# Altium project pcb_project.prjpcb (part 2 of 2)

## Sheet Analog_Current_Output.SchDoc
size A3; Organization: Altium Limited; Address1: L3, 12a Rodborough Rd; Address2: Frenchs Forest; Address3: NSW; Address4: Australia 2086
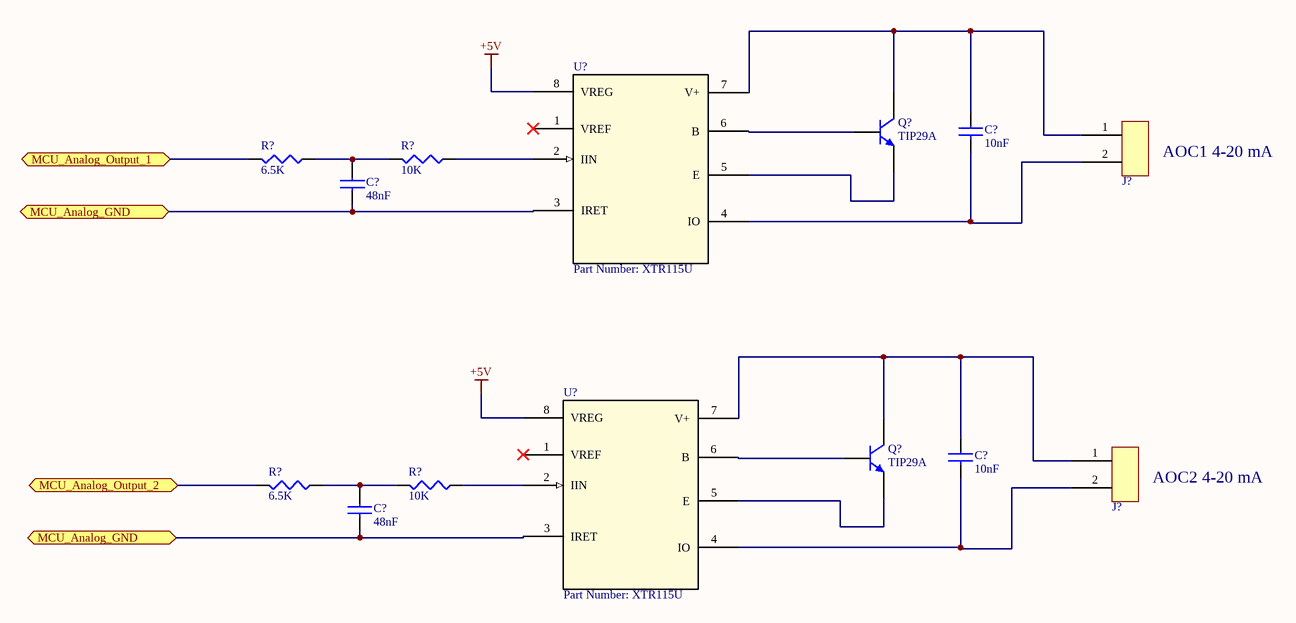
[diagram p8: Analog_Current_Output.SchDoc]

### Parts
(Parts that share a designator on the sheet are numbered #1, #2 ... from top to bottom, then left to right.)
C?#31  value 10nF  [0402 SMD Ceramic Capacitor]  (hidden comment: 0402_10nF)
C?#32  value 48nF  [0805 SMD Ceramic Capacitor]  (hidden comment: C0805C333)
C?#33  value 10nF  [0402 SMD Ceramic Capacitor]  (hidden comment: 0402_10nF)
C?#34  value 48nF  [0805 SMD Ceramic Capacitor]  (hidden comment: C0805C333)
J?#18  2x Terminal  [2x Terminal mini]  (value not drawn)
J?#19  2x Terminal  [2x Terminal mini]  (value not drawn)
Q?#2  TIP29A  [TO220 SMD]
Q?#3  TIP29A  [TO220 SMD]
R?#56  value 6.5K  [0805 Resistor]  (hidden comment: 0805_1K)
R?#57  value 10K  [0805 Resistor]  (hidden comment: 0805_1K)
R?#58  value 6.5K  [0805 Resistor]  (hidden comment: 0805_1K)
R?#59  value 10K  [0805 Resistor]  (hidden comment: 0805_1K)
U?#17  Part Number: XTR115U  [D8]
U?#18  Part Number: XTR115U  [D8]

### Ports
MCU_Analog_GND (bidir), MCU_Analog_Output_1 (bidir), MCU_Analog_Output_2 (bidir)

### Nets
+5V: U?#17.8(VREG) U?#18.8(VREG)
NetC?#31_1: C?#31.1 J?#18.1 Q?#2.2(C) U?#17.7(V+)
NetC?#31_2: C?#31.2 J?#18.2 U?#17.4(IO)
NetC?#32_1: C?#32.1 R?#56.1 R?#57.2
NetC?#32_2: C?#32.2 C?#34.2 U?#17.3(IRET) U?#18.3(IRET) ; port MCU_Analog_GND
NetC?#33_1: C?#33.1 J?#19.1 Q?#3.2(C) U?#18.7(V+)
NetC?#33_2: C?#33.2 J?#19.2 U?#18.4(IO)
NetC?#34_1: C?#34.1 R?#58.1 R?#59.2
NetQ?#2_1: Q?#2.1(B) U?#17.6(B)
NetQ?#2_3: Q?#2.3(E) U?#17.5(E)
NetQ?#3_1: Q?#3.1(B) U?#18.6(B)
NetQ?#3_3: Q?#3.3(E) U?#18.5(E)
NetR?#56_2: R?#56.2 ; port MCU_Analog_Output_1
NetR?#57_1: R?#57.1 U?#17.2(IIN)
NetR?#58_2: R?#58.2 ; port MCU_Analog_Output_2
NetR?#59_1: R?#59.1 U?#18.2(IIN)

Not connected (* = marked no-connect by the designer): U?#17 1(VREF)*; U?#18 1(VREF)*

### Notes on the sheet
- (near J?#18) AOC1 4-20 mA
- (near J?#19) AOC2 4-20 mA
- Title
- Size:
- Date:
- A3
- Number:
- Time:
- Revision:
- Sheet
- of
- File:

### Library data of the parts
C?#31 C?#33 = 0402_10nF: Manufacturer: MURATA; Manufacturer Code: GRM155R71C103KA01D; Tolerance: ±10%; Voltage: 25V; Dielectric Characteristic: X7R; Unit Price: 0,014 €; Farnell Code: 8819734; MOQ: 10; Package: 0402
C?#32 C?#34 = C0805C333: Manufacturer Code: MC0805B333K500CT; Manufacturer: MULTICOMP; Voltage: 50V; Tolerace: ± 10%; Farnell Code: 1759257; Unit Price: 0,022 €; MOQ: 10; Package: 0805
J?#18 J?#19 = 2x Terminal: Manufacturer: WEIDMULLER; Manufacturer Code: PM5.08/2/90 BLK; Value: 2x Terminal; Farnell Code: 1131855; Unit Price: 0,55 €
Q?#2 Q?#3 = TIP29A: Manufacturer: STM Electronics; Voltage: 60V; Manufacturer Code: TIP29A; Unit Price: 0,19 €; Q?: TIP29A
R?#56-R?#59 = 0805_1K: Manufacturer Code: MC01W080511K; Manufacturer: MULTICOMP; Tolerance: ±1%; Farnell Code: 9332383; Unit Price: 0,03 €
U?#17 U?#18 = XTR115U: 4-20mA Current Loop Transmitters; Manufacturer: Texas Instruments; GENERIC_PART_NUMBER: XTR115; INDUSTRY_STD_PKG_TYPE: SOIC; FAMILY_NAME: 4-20MA CONDITIONING; PIN_COUNT: 8; PACKAGE_DESIGNATOR: D; Datasheet_URL: http://www.ti.com/lit/gpn/XTR115; Vendor: Texas Instruments; Manufacturer_Part_Number: XTR115U; Copyright: Copyright (C) 2018 Accelerated Designs. All rights reserved; RefDes: RefDes; Type: DEV; Value: Value

## Sheet Frequency_Output.SchDoc
size A3; Organization: Altium Limited; Address1: L3, 12a Rodborough Rd; Address2: Frenchs Forest; Address3: NSW; Address4: Australia 2086
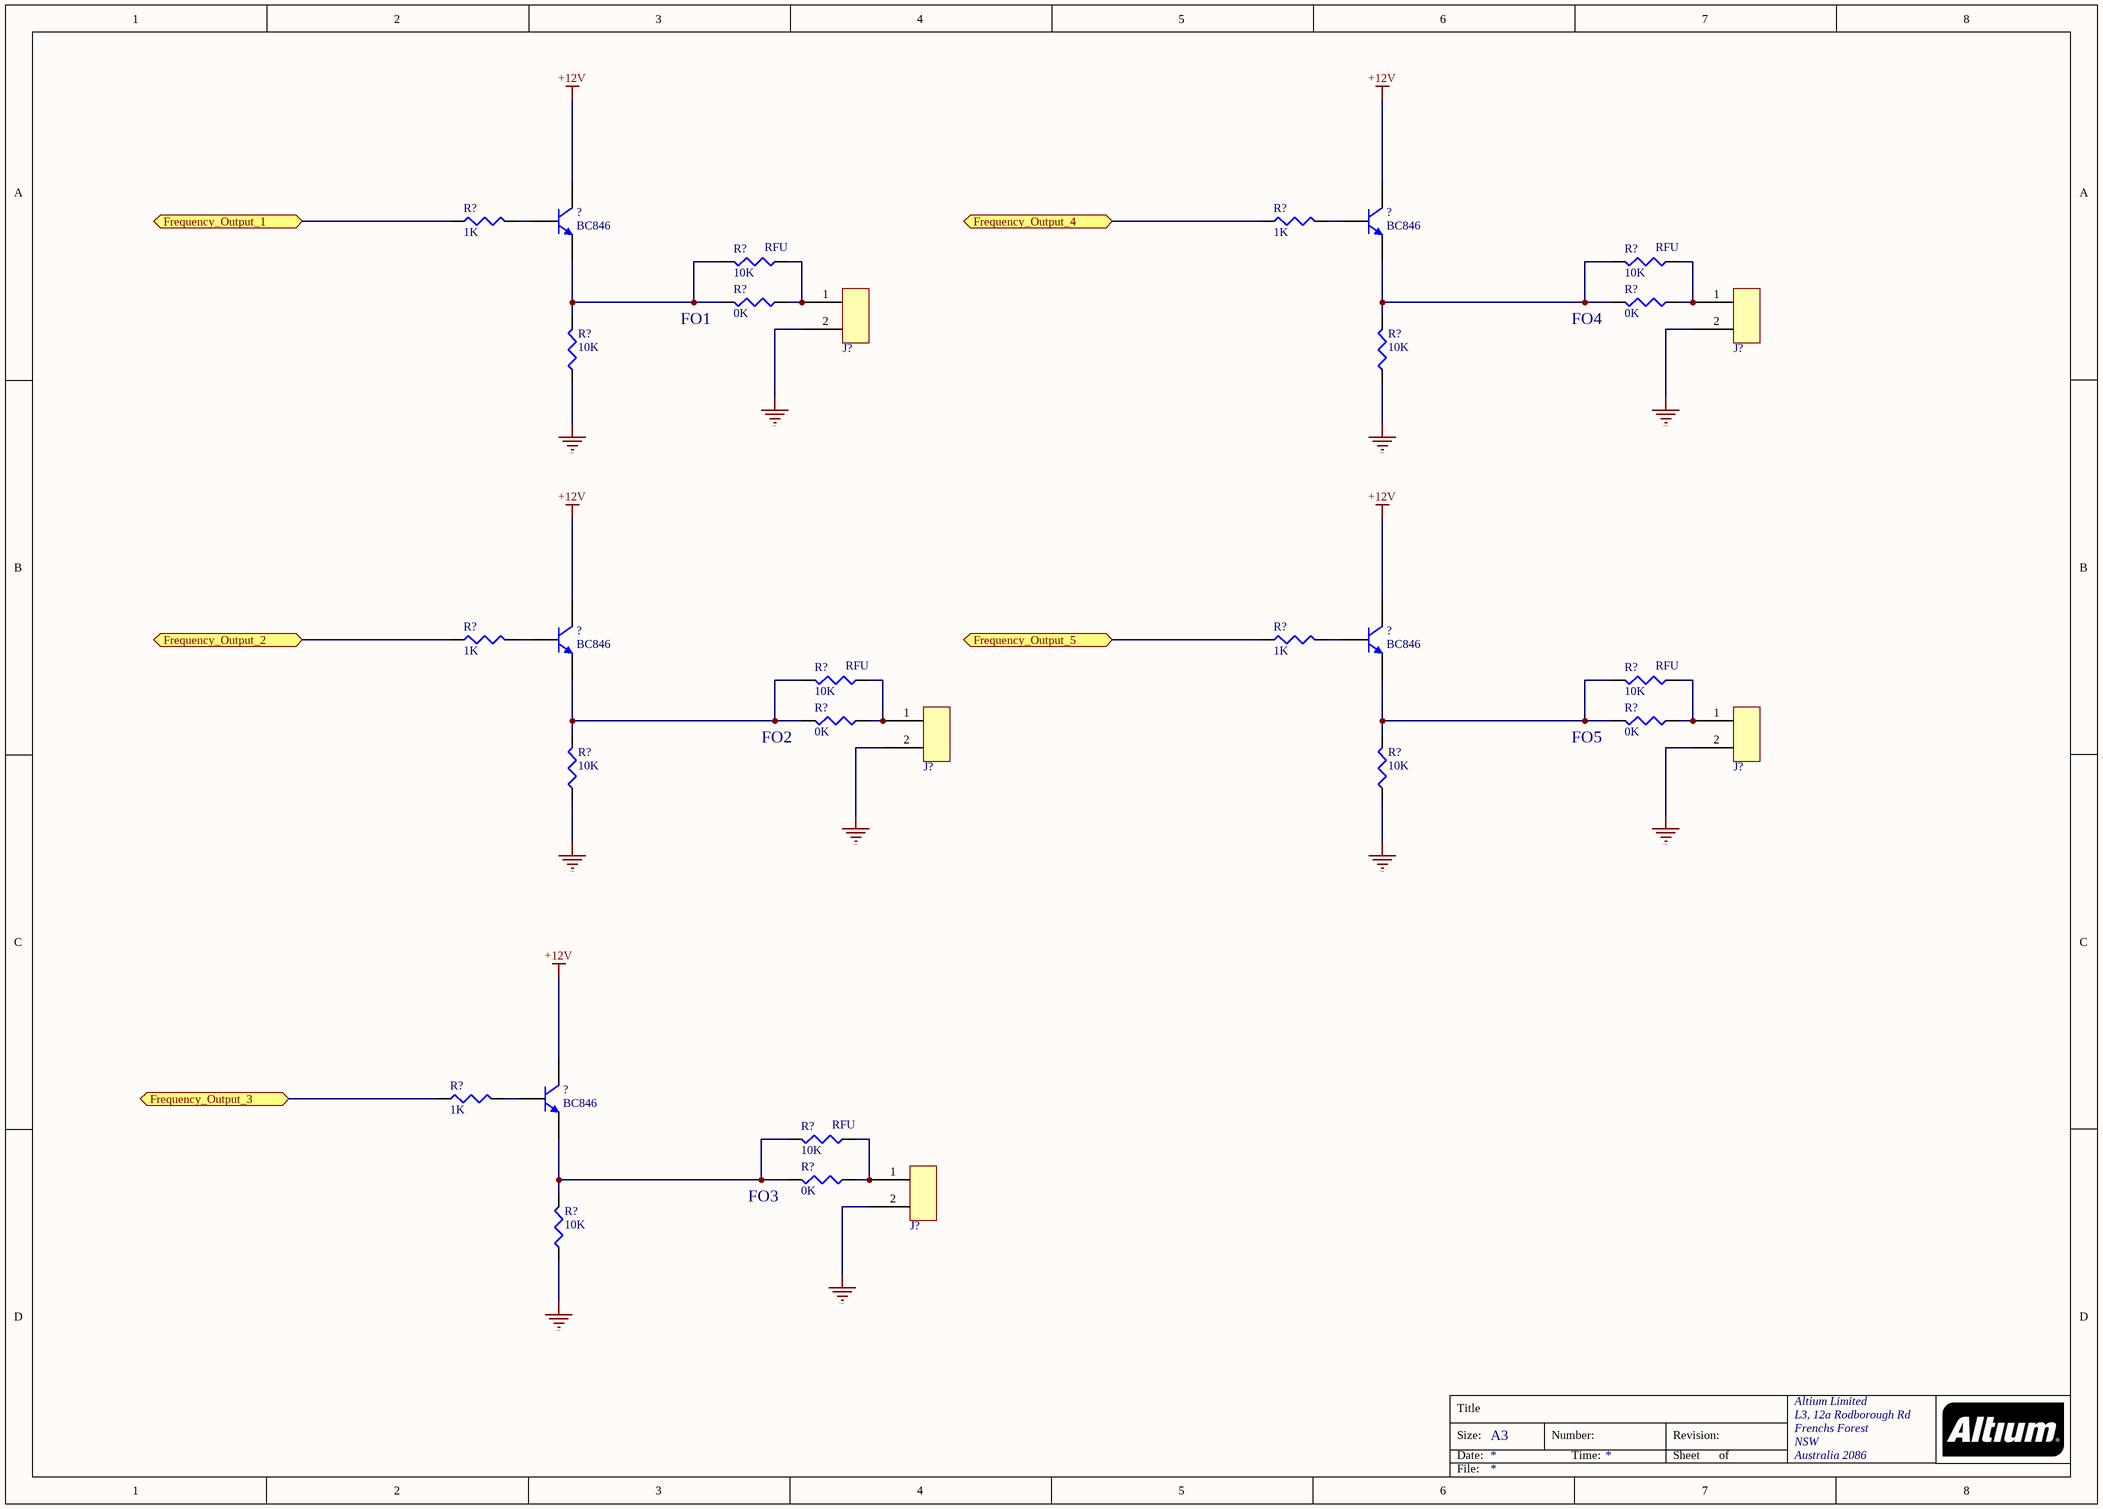
[diagram p9: Frequency_Output.SchDoc]

### Parts
(Parts that share a designator on the sheet are numbered #1, #2 ... from top to bottom, then left to right.)
?#1  BC846  [SOT23]
?#2  BC846  [SOT23]
?#3  BC846  [SOT23]
?#4  BC846  [SOT23]
?#5  BC846  [SOT23]
J?#20  2x Terminal  [2x Terminal mini]  (value not drawn)
J?#21  2x Terminal  [2x Terminal mini]  (value not drawn)
J?#22  2x Terminal  [2x Terminal mini]  (value not drawn)
J?#23  2x Terminal  [2x Terminal mini]  (value not drawn)
J?#24  2x Terminal  [2x Terminal mini]  (value not drawn)
R?#60  value 1K  [0805 Resistor]  (hidden comment: 0805_1K)
R?#61  value 1K  [0805 Resistor]  (hidden comment: 0805_1K)
R?#62  value 10K  [0805 Resistor]  (hidden comment: 0805_10K)
R?#63  value 10K  [0805 Resistor]  (hidden comment: 0805_10K)
R?#64  value 0K  [0805 Resistor]  (hidden comment: 0805_10K)
R?#65  value 0K  [0805 Resistor]  (hidden comment: 0805_10K)
R?#66  value 10K  [0805 Resistor]  (hidden comment: 0805_10K)
R?#67  value 10K  [0805 Resistor]  (hidden comment: 0805_10K)
R?#68  value 1K  [0805 Resistor]  (hidden comment: 0805_1K)
R?#69  value 1K  [0805 Resistor]  (hidden comment: 0805_1K)
R?#70  value 10K  [0805 Resistor]  (hidden comment: 0805_10K)
R?#71  value 10K  [0805 Resistor]  (hidden comment: 0805_10K)
R?#72  value 0K  [0805 Resistor]  (hidden comment: 0805_10K)
R?#73  value 0K  [0805 Resistor]  (hidden comment: 0805_10K)
R?#74  value 10K  [0805 Resistor]  (hidden comment: 0805_10K)
R?#75  value 10K  [0805 Resistor]  (hidden comment: 0805_10K)
R?#76  value 1K  [0805 Resistor]  (hidden comment: 0805_1K)
R?#77  value 10K  [0805 Resistor]  (hidden comment: 0805_10K)
R?#78  value 0K  [0805 Resistor]  (hidden comment: 0805_10K)
R?#79  value 10K  [0805 Resistor]  (hidden comment: 0805_10K)

### Ports
Frequency_Output_1 (bidir), Frequency_Output_2 (bidir), Frequency_Output_3 (bidir), Frequency_Output_4 (bidir), Frequency_Output_5 (bidir)

### Nets
+12V: ?#1.3(C) ?#2.3(C) ?#3.3(C) ?#4.3(C) ?#5.3(C)
GND: J?#20.2 J?#21.2 J?#22.2 J?#23.2 J?#24.2 R?#66.1 R?#67.1 R?#74.1 R?#75.1 R?#79.1
Net?#1_1: ?#1.1(B) R?#60.2
Net?#1_2: ?#1.2(E) R?#62.2 R?#64.2 R?#66.2
Net?#2_1: ?#2.1(B) R?#61.2
Net?#2_2: ?#2.2(E) R?#63.2 R?#65.2 R?#67.2
Net?#3_1: ?#3.1(B) R?#68.2
Net?#3_2: ?#3.2(E) R?#70.2 R?#72.2 R?#74.2
Net?#4_1: ?#4.1(B) R?#69.2
Net?#4_2: ?#4.2(E) R?#71.2 R?#73.2 R?#75.2
Net?#5_1: ?#5.1(B) R?#76.2
Net?#5_2: ?#5.2(E) R?#77.2 R?#78.2 R?#79.2
NetJ?#20_1: J?#20.1 R?#62.1 R?#64.1
NetJ?#21_1: J?#21.1 R?#63.1 R?#65.1
NetJ?#22_1: J?#22.1 R?#70.1 R?#72.1
NetJ?#23_1: J?#23.1 R?#71.1 R?#73.1
NetJ?#24_1: J?#24.1 R?#77.1 R?#78.1
NetR?#60_1: R?#60.1 ; port Frequency_Output_1
NetR?#61_1: R?#61.1 ; port Frequency_Output_4
NetR?#68_1: R?#68.1 ; port Frequency_Output_2
NetR?#69_1: R?#69.1 ; port Frequency_Output_5
NetR?#76_1: R?#76.1 ; port Frequency_Output_3

### Notes on the sheet
- (near R?#62) RFU
- (near R?#63) RFU
- (near R?#64) FO1
- (near R?#65) FO4
- (near R?#70) RFU
- (near R?#71) RFU
- (near R?#72) FO2
- (near R?#73) FO5
- (near R?#77) RFU
- (near R?#78) FO3
- Title
- Size:
- Date:
- A3
- Number:
- Time:
- Revision:
- Sheet
- of
- File:

### Library data of the parts
?#1-?#5 = BC846: Manufacturer: NXP Semiconductors; Voltage: 65V; Farnell Code: 1081227; Manufacturer Code: BC846; Unit Price: 0,049 €; Value: BC846
J?#20-J?#24 = 2x Terminal: as J?#18 on sheet Analog_Current_Output; Value: 2x Terminal; Farnell Code: 1131855; Unit Price: 0,55 €
R?#60 R?#61 R?#68 R?#69 R?#76 = 0805_1K: as R?#56 on sheet Analog_Current_Output; Farnell Code: 9332383; Unit Price: 0,03 €
R?#62-R?#67 R?#70-R?#75 R?#77-R?#79 = 0805_10K: Manufacturer Code: MC 0.1W 0805 1% 10K; Manufacturer: MULTICOMP; Tolerance: ±1%; Farnell Code: 9332391; Unit Price: 0,03 €

## Nets that join several sheets
+3.3V: Sheet2 (8 pins), Power (C?#11.1 D?#1.1 L?#1.1 U.2), opto_input (R11#2.1 R13#2.1 R15.1 R17.1), Serial and Ethernet (L?#7.1), Resistive_Load_Output (L?#8.1 L?#9.1)
+5V: Power (8 pins), Analog_Voltage_Outputs (U?#8.3 U?#8.4 U?#8.18), Analog Inputs (L8.1 L9.1 L10.1), Analog_Current_Output (U?#17.8 U?#18.8)
+12V: Power (7 pins), Analog_Voltage_Outputs (U?#5.4 U?#11.4), Frequency_Output (5 pins)
GND: Sheet2 (45 pins), Power (39 pins), opto_input (8 pins), Analog_Voltage_Outputs (33 pins), Analog Inputs (21 pins), Serial and Ethernet (C?#28.1 U?#14.5), Resistive_Load_Output (9 pins), Frequency_Output (10 pins)
VSNS: Sheet2 (R28.1 R29.2 U6.4), Power (R?#11.1 R?#12.2 U?#2.4)